# EAGLE design 4ch (EAGLE 5.11)

## Sheet 1 of 4
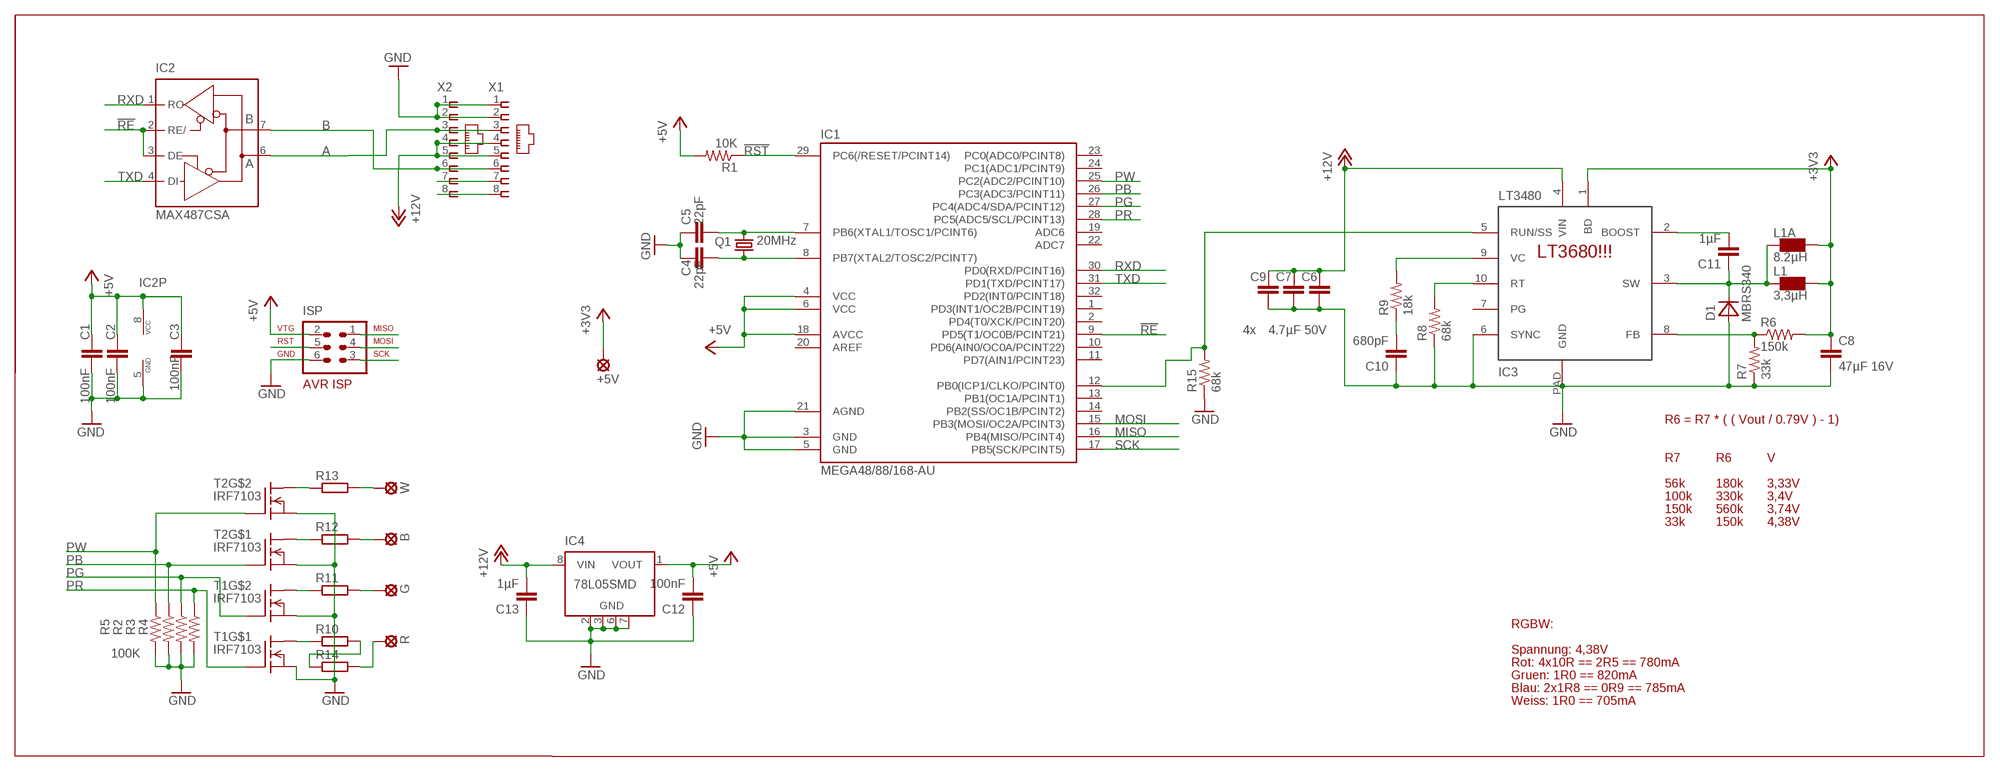
[diagram p0: schematic, sheet 1]

### Parts
+5V  SE14  [SE14]
B  SE14  [SE14]
C1  100nF  CAP0402-CAP  [0402-CAP]
C2  100nF  CAP0402-CAP  [0402-CAP]
C3  100nF  CAP0402-CAP  [0402-CAP]
C4  22pF  CAP0402-CAP  [0402-CAP]
C5  22pF  CAP0402-CAP  [0402-CAP]
C6  4.7µF 50V  CAP1210  [1210]
C7  4.7µF 50V  CAP1210  [1210]
C8  47µF 16V  CAP1210  [1210]
C9  4.7µF 50V  CAP1210  [1210]
C10  680pF  CAP0805  [0805]
C11  1µF  CAP0805  [0805]
C12  100nF  CAP0402-CAP  [0402-CAP]
C13  1µF  CAP0805  [0805]
D1  MBRS340  [DO214AB]
G  SE14  [SE14]
IC1  MEGA48/88/168-AU  [TQFP32-08]
IC2  MAX487CSA  MAX481CSA  [SO08]
IC3  LT3972  LT3480  [MSOP10-PAD]
IC4  78L05SMD  [SO08]
ISP  AVR-ISP-6  [AVR-ISP-6]
L1  3,3µH  TDK_RLF7030  [RLF7030]
L1A  8.2µH  IHLP-2525CZ  [IHLP-2525CZ]
Q1  20MHz  X22-OSCILLATOR  [X22]
R  SE14  [SE14]
R1  10K  RESISTOR0402-RES  [0402-RES]
R2  100K  RESISTOR0402-RES  [0402-RES]
R3  100K  RESISTOR0402-RES  [0402-RES]
R4  100K  RESISTOR0402-RES  [0402-RES]
R5  100K  RESISTOR0402-RES  [0402-RES]
R6  150k  RESISTOR0805-RES  [0805]
R7  33k  RESISTOR0805-RES  [0805]
R8  68k  RESISTOR0805-RES  [0805]
R9  18k  RESISTOR0805-RES  [0805]
R10  R-EU_MELF0207R  [MINI_MELF-0207R]
R11  R-EU_MELF0207R  [MINI_MELF-0207R]
R12  R-EU_MELF0207R  [MINI_MELF-0207R]
R13  R-EU_MELF0207R  [MINI_MELF-0207R]
R14  R-EU_MELF0207R  [MINI_MELF-0207R]
R15  68k  RESISTOR0402-RES  [0402-RES]
T1  IRF7103  [SO-8]
T2  IRF7103  [SO-8]
W  SE14  [SE14]
X1  RJ45-8L-B  [RJ45-NO-SHIELD]
X2  RJ45-8L-B  [RJ45-NO-SHIELD]

### Nets
!RE: IC1.9(PD5(T1/OC0B/PCINT21)) IC2.2(RE/) IC2.3(DE)
!RST: IC1.29(PC6(/RESET/PCINT14)) ISP.5 R1.1
+3V3: +5V.MP C8.1 IC3.1(BD) L1.P$1 L1A.P$1 R6.2
+5V: C1.1 C2.1 C3.1 C12.2 IC1.4(VCC) IC1.6(VCC) IC1.18(AVCC) IC2.8(VCC) IC4.1(VOUT) ISP.2 R1.2
+12V: C6.1 C7.1 C9.1 C13.2 IC3.4(VIN) IC4.8(VIN) X1.4 X1.5 X2.4 X2.5
A: IC2.6(A) X1.3 X2.3
B: IC2.7(B) X1.6 X2.6
GND: C1.2 C2.2 C3.2 C4.1 C5.1 C6.2 C7.2 C8.2 C9.2 C10.1 C12.1 C13.1 D1.A IC1.3(GND) IC1.5(GND) IC1.21(AGND) IC2.5(GND) IC3.6(SYNC) IC3.PAD(GND) IC4.2(GND) IC4.3(GND) IC4.6(GND) IC4.7(GND) ISP.6 R2.2 R3.2 R4.2 R5.2 R7.1 R8.1 R15.1 T1.1(S) T1.3(S) T2.1(S) T2.3(S) X1.1 X1.2 X2.1 X2.2
MISO: IC1.16(PB4(MISO/PCINT4)) ISP.1
MOSI: IC1.15(PB3(MOSI/OC2A/PCINT3)) ISP.4
N$1: R10.1 T1.8(D1)
N$2: R13.2 W.MP
N$3: R13.1 T2.5(D1)
N$4: R11.1 T1.5(D1)
N$5: R12.1 T2.8(D1)
N$6: IC3.10(RT) R8.2
N$8: G.MP R11.2
N$9: B.MP R12.2
N$10: C10.2 R9.1
N$11: R10.2 R14.1
N$12: IC1.12(PB0(ICP1/CLKO/PCINT0)) IC3.5(RUN/SS) R15.2
N$13: R14.2 R.MP
N$14: IC3.9(VC) R9.2
N$15: C11.1 D1.K(C) IC3.3(SW) L1.P$2 L1A.P$2
N$16: IC3.8(FB) R6.1 R7.2
N$17: C11.2 IC3.2(BOOST)
N$18: X1.7 X2.7
N$19: X1.8 X2.8
PB: IC1.26(PC3(ADC3/PCINT11)) R2.1 T2.2(G)
PG: IC1.27(PC4(ADC4/SDA/PCINT12)) R3.1 T1.4(G)
PR: IC1.28(PC5(ADC5/SCL/PCINT13)) R4.1 T1.2(G)
PW: IC1.25(PC2(ADC2/PCINT10)) R5.1 T2.4(G)
RXD: IC1.30(PD0(RXD/PCINT16)) IC2.1(RO)
SCK: IC1.17(PB5(SCK/PCINT5)) ISP.3
TXD: IC1.31(PD1(TXD/PCINT17)) IC2.4(DI)
XTAL1: C5.2 IC1.7(PB6(XTAL1/TOSC1/PCINT6)) Q1.3
XTAL2: C4.2 IC1.8(PB7(XTAL2/TOSC2/PCINT7)) Q1.1
Unconnected: IC1.1(PD3(INT1/OC2B/PCINT19)) IC1.2(PD4(T0/XCK/PCINT20)) IC1.10(PD6(AIN0/OC0A/PCINT22)) IC1.11(PD7(AIN1/PCINT23)) IC1.13(PB1(OC1A/PCINT1)) IC1.14(PB2(SS/OC1B/PCINT2)) IC1.19(ADC6) IC1.20(AREF) IC1.22(ADC7) IC1.23(PC0(ADC0/PCINT8)) IC1.24(PC1(ADC1/PCINT9)) IC1.32(PD2(INT0/PCINT18)) IC3.7(PG) IC4.4(NC) IC4.5(NC) T1.6(D) T1.7(D) T2.6(D) T2.7(D)

### Notes on the sheet
- LT3680!!!
- 4x
- R6 = R7 * ( ( Vout / 0.79V ) - 1)
- R7 | R6 | V
- 56k | 180k | 3,33V
- 100k | 330k | 3,4V
- 150k | 560k | 3,74V
- 33k | 150k | 4,38V
- RGBW:
- Spannung: 4,38V
- Rot: 4x10R == 2R5 == 780mA
- Gruen: 1R0 == 820mA
- Blau: 2x1R8 == 0R9 == 785mA
- Weiss: 1R0 == 705mA

## Sheet 2 of 4
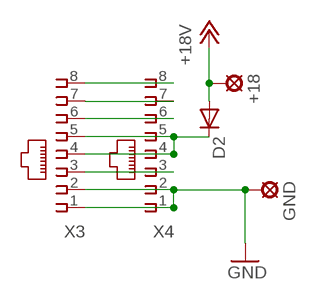
[diagram p1: schematic, sheet 2]

### Parts
+18  SE14  [SE14]
D2  DIODE-TO220V  [TO220ACS]
GND  SE14  [SE14]
X3  RJ45-8L-B  [RJ45-NO-SHIELD]
X4  RJ45-8L-B  [RJ45-NO-SHIELD]

### Nets
+18V: +18.MP D2.A
+18V_PI: D2.C X3.4 X3.5 X4.4 X4.5
A_PI: X3.3 X4.3
B_PI: X3.6 X4.6
GND_PI: GND.MP X3.1 X3.2 X4.1 X4.2 ; supply symbol labelled GND
N$20: X3.7 X4.7
N$21: X3.8 X4.8

## Sheet 3 of 4
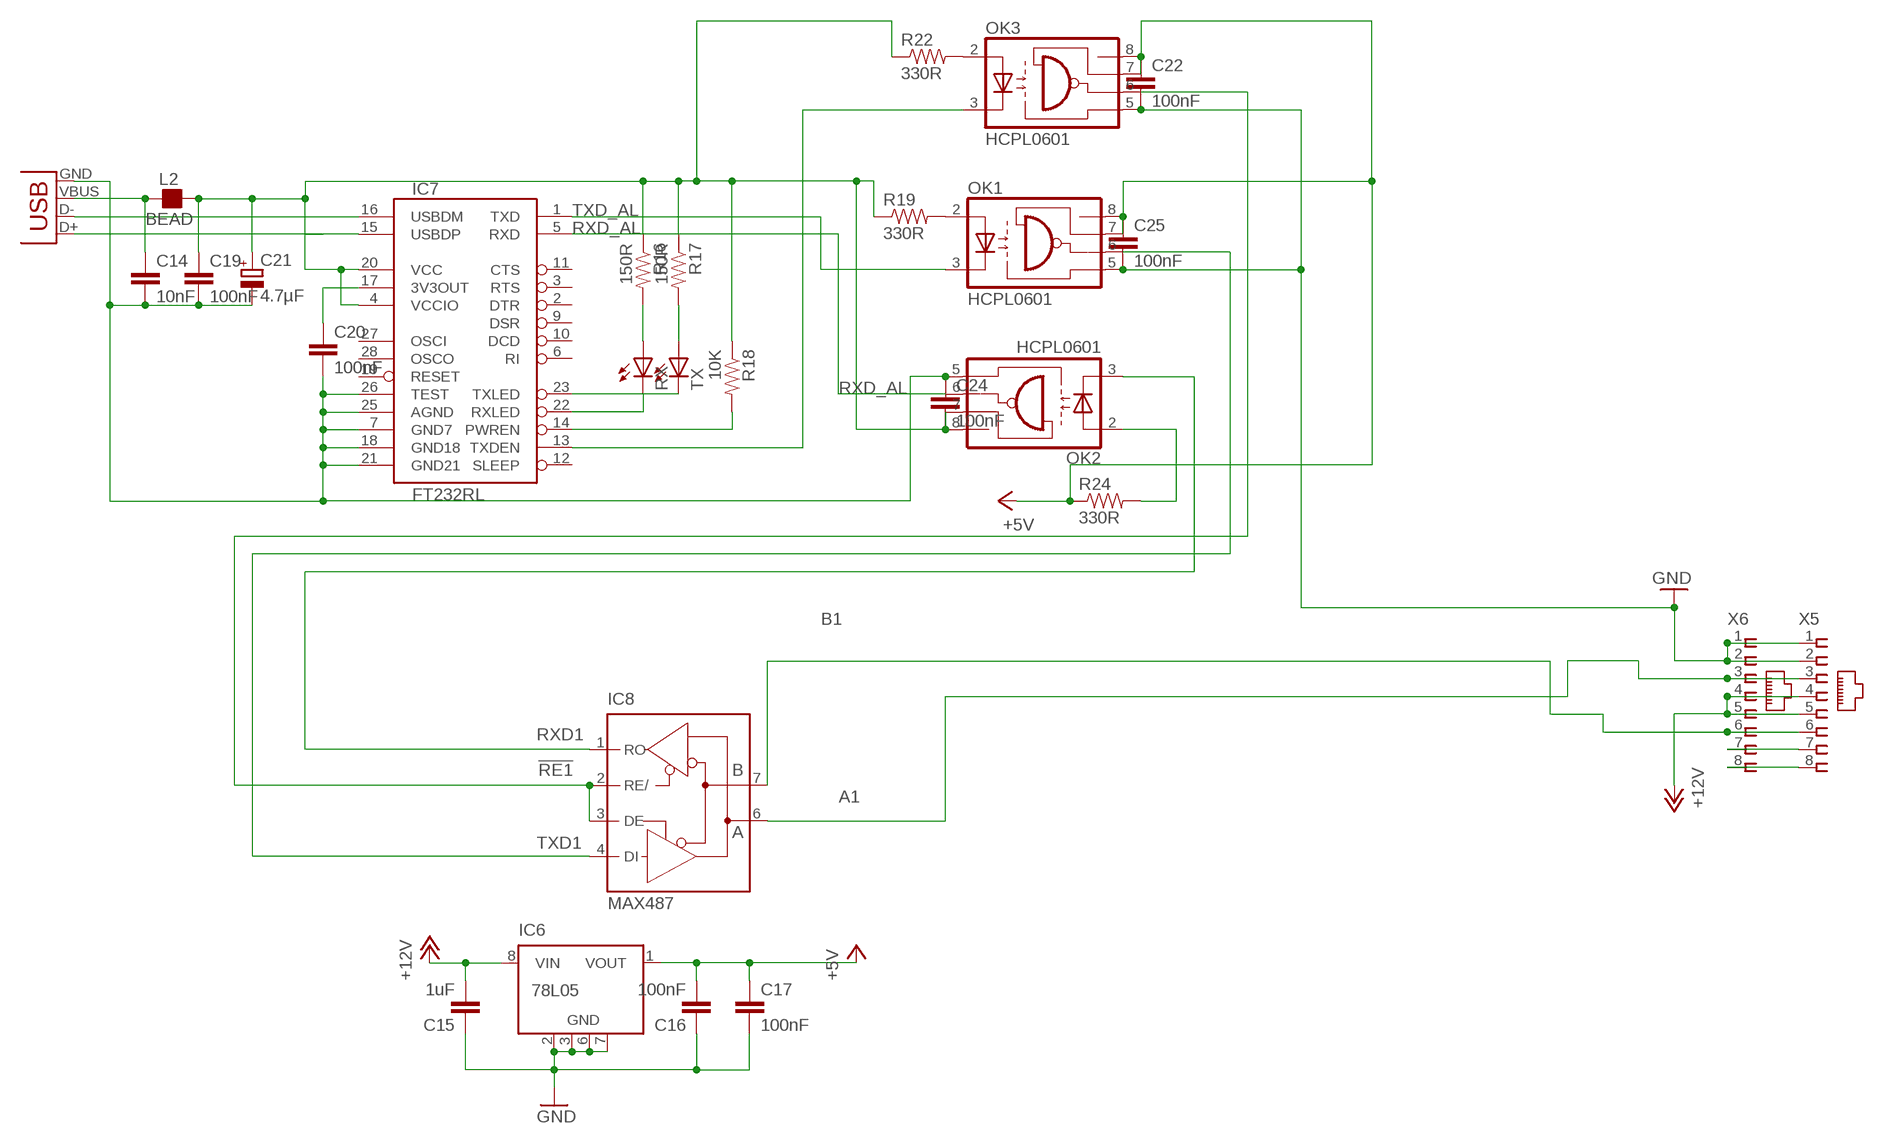
[diagram p2: schematic, sheet 3]

### Parts
C14  10nF  CAP0805  [0805]
C15  1uF  CAP0805  [0805]
C16  100nF  CAP0805  [0805]
C17  100nF  CAP0805  [0805]
C19  100nF  CAP0805  [0805]
C20  100nF  CAP0805  [0805]
C21  4.7µF  CPOL-EUSMCC  [SMC_C]
C22  100nF  CAP0805  [0805]
C24  100nF  CAP0805  [0805]
C25  100nF  CAP0805  [0805]
IC6  78L05  78L05SMD  [SO08]
IC7  FT232RL  FT232RLSSOP  [SSOP28DB]
IC8  MAX487  MAX481CSA  [SO08]
L2  BEAD  FB_0805  [L0805]
OK1  HCPL0601  [SOIC08]
OK2  HCPL0601  [SOIC08]
OK3  HCPL0601  [SOIC08]
R16  150R  RESISTOR0805-RES  [0805]
R17  150R  RESISTOR0805-RES  [0805]
R18  10K  RESISTOR0805-RES  [0805]
R19  330R  RESISTOR0805-RES  [0805]
R22  330R  RESISTOR0805-RES  [0805]
R24  330R  RESISTOR0805-RES  [0805]
RX  LEDCHIP-LED0805  [CHIP-LED0805]
TX  LEDCHIP-LED0805  [CHIP-LED0805]
X5  RJ45-8L-B  [RJ45-NO-SHIELD]
X6  RJ45-8L-B  [RJ45-NO-SHIELD]
X7  USB-SMD-NS  [USB-MINIB-NOSTOP]

### Nets
!RE1: IC8.2(RE/) IC8.3(DE) OK3.6(VO)
+5V1: C16.2 C17.1 C22.1 C25.1 IC6.1(VOUT) OK1.7(VE) OK1.8(VCC) OK3.7(VE) OK3.8(VCC) R24.1 ; supply symbol labelled +5V
+24V: C15.2 IC6.8(VIN) X5.4 X5.5 X6.4 X6.5 ; supply symbol labelled +12V
+USB_SIEVED: C19.1 C21.+ C24.2 IC7.4(VCCIO) IC7.20(VCC) L2.2 OK2.7(VE) OK2.8(VCC) R16.1 R17.1 R18.1 R19.1 R22.1
A1: IC8.6(A) X5.3 X6.3
B1: IC8.7(B) X5.6 X6.6
GND_AL: C15.1 C16.1 C17.2 C22.2 C25.2 IC6.2(GND) IC6.3(GND) IC6.6(GND) IC6.7(GND) OK1.5(GND) OK3.5(GND) X5.1 X5.2 X6.1 X6.2 ; supply symbol labelled GND
GND_USB: C14.2 C19.2 C20.2 C21.- C24.1 IC7.7(GND7) IC7.18(GND18) IC7.21(GND21) IC7.25(AGND) IC7.26(TEST) OK2.5(GND) X7.GND
N$7: IC7.16(USBDM) X7.D-
N$22: X5.8 X6.8
N$23: X5.7 X6.7
N$24: IC7.15(USBDP) X7.D+
N$25: R16.2 RX.A
N$26: R17.2 TX.A
N$27: IC7.22(RXLED) RX.C
N$28: IC7.23(TXLED) TX.C
N$29: C20.1 IC7.17(3V3OUT)
N$30: C14.1 L2.1 X7.VBUS
N$31: IC7.14(PWREN) R18.2
N$32: OK1.2(A) R19.2
N$35: IC7.13(TXDEN) OK3.3(C)
N$37: OK2.2(A) R24.2
N$44: OK3.2(A) R22.2
RXD1: IC8.1(RO) OK2.3(C)
RXD_AL: IC7.5(RXD) OK2.6(VO)
TXD1: IC8.4(DI) OK1.6(VO)
TXD_AL: IC7.1(TXD) OK1.3(C)
Unconnected: IC6.4(NC) IC6.5(NC) IC7.2(DTR) IC7.3(RTS) IC7.6(RI) IC7.9(DSR) IC7.10(DCD) IC7.11(CTS) IC7.12(SLEEP) IC7.19(RESET) IC7.27(OSCI) IC7.28(OSCO)

## Sheet 4 of 4
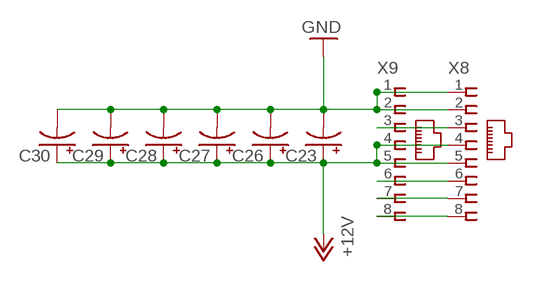
[diagram p3: schematic, sheet 4]

### Parts
C23  CAP_POLH13  [PANASONIC_H13]
C26  CAP_POLH13  [PANASONIC_H13]
C27  CAP_POLH13  [PANASONIC_H13]
C28  CAP_POLH13  [PANASONIC_H13]
C29  CAP_POLH13  [PANASONIC_H13]
C30  CAP_POLH13  [PANASONIC_H13]
X8  RJ45-8L-B  [RJ45-NO-SHIELD]
X9  RJ45-8L-B  [RJ45-NO-SHIELD]

### Nets
+24V_SB: C23.+ C26.+ C27.+ C28.+ C29.+ C30.+ X8.4 X8.5 X9.4 X9.5 ; supply symbol labelled +12V
A1_1: X8.3 X9.3
B1_1: X8.6 X9.6
GND_SB: C23.- C26.- C27.- C28.- C29.- C30.- X8.1 X8.2 X9.1 X9.2 ; supply symbol labelled GND
N$33: X8.8 X9.8
N$34: X8.7 X9.7

## Power pins joined to a net without a drawn wire
+5V1: IC8.8(VCC)
GND_AL: IC8.5(GND)

## Library data of the parts
+5V +18 B G GND R W = solpad:SE14: SOLDER PAD E1553, drill 1,4mm, distributor Buerklin, 07F820
C1-C17 C19 C20 C22 C24 C25 = SparkFun:CAP: Capacitor Standard 0603 ceramic capacitor, and 0.1" leaded capacitor.
C21 = resistor:CPOL-EU: POLARIZED CAPACITOR, European symbol
C23 C26-C30 = SparkFun:CAP_POL: Capacitor Polarized These are standard SMD and PTH capacitors. Normally 10uF, 47uF, and 100uF in electrolytic and tantalum varieties. Always verify the external diameter of the through hole cap, it varies with capacity, voltage, and manufacturer. The EIA devices should be standard.
D1 = seb:MBRS340
D2 = diode:DIODE-: DIODE
IC1 = avr-7:MEGA48/88/168
IC2 IC8 = maxim:MAX481CSA: RS485 TRANSEIVER; MF: MAXIM; MPN: MAX481CSA; OC_FARNELL: unknown; OC_NEWARK: 90C3817
IC3 = seb:LT3480
IC4 IC6 = linear:78L*SMD: Positive VOLTAGE REGULATOR
IC7 = SparkFun:FT232RL: USB UART FT232RL 4th Generation USB UART (USB <-> Serial) Controller. Spark Fun Electronics SKU : COM-00650
ISP = atmel:AVR-ISP-6: AVR ISP-6 Serial Programming Header
L1 = seb:TDK_RLF7030
L1A = seb:IHLP-2525CZ
L2 = rc-master-smd:FB_: FERRITE BEAD
OK1-OK3 = optocoupler:HCPL0601: HEWLETT PACKARD OPTO COUPLER; MF: AGILENT TECHNOLOGIES; MPN: HCPL-0601-000E; OC_FARNELL: 9995102; OC_NEWARK: 88H7776
Q1 = seb:X22-OSCILLATOR
R1-R9 R15-R19 R22 R24 = SparkFun:RESISTOR: Resistor Basic schematic elements and footprints for 0603, 1206, and PTH resistors.
R10-R14 = rcl:R-EU_: RESISTOR, European symbol
RX TX = led:LED: LED OSRAM: - CHIPLED LG R971, LG N971, LY N971, LG Q971, LY Q971, LO R971, LY R971 LH N974, LH R974 LS Q976, LO Q976, LY Q976 LO Q996 - Hyper CHIPLED LW Q18S LB Q993, LB Q99A, LB R99A - SideLED LS A670, LO A670, LY A670, LG A670, LP A670 LB A673, LV A673, LT A673, LW A673 LH A674 LY A675 LS A676, LA A676, LO A676, LY A676, LW A676 LS A679, LY A679, LG A679 - Hyper Micro SIDELED® LS Y876, LA Y876, LO Y876, LY Y876 LT Y87S - SmartLED LW L88C, LW L88S LB L89C, LB L89S, LG L890 LS L89K, LO L89K, LY L89K LS L896, LA L896, LO L896, LY L896 - TOPLED LS T670, LO T670, LY T670, LG T670, LP T670 LSG T670, LSP T670, LSY T670, LOP T670, LYG T670 LG T671, LOG T671, LSG T671 LB T673, LV T673, LT T673, LW T673 LH T674 LS T676, LA T676, LO T676, LY T676, LB T676, LH T676, LSB T676, LW T676 LB T67C, LV T67C, LT T67C, LS T67K, LO T67K, LY T67K, LW E67C LS E67B, LA E67B, LO E67B, LY E67B, LB E67C, LV E67C, LT E67C LW T67C LS T679, LY T679, LG T679 LS T770, LO T770, LY T770, LG T770, LP T770 LB T773, LV T773, LT T773, LW T773 LH T774 LS E675, LA E675, LY E675, LS T675 LS T776, LA T776, LO T776, LY T776, LB T776 LHGB T686 LT T68C, LB T68C - Hyper Mini TOPLED® LB M676 - Mini TOPLED Santana® LG M470 LS M47K, LO M47K, LY M47K Source: http://www.osram.convergy.de LUXEON: - LUMILED® LXK2-PW12-R00, LXK2-PW12-S00, LXK2-PW14-U00, LXK2-PW14-V00 LXK2-PM12-R00, LXK2-PM12-S00, LXK2-PM14-U00 LXK2-PE12-Q00, LXK2-PE12-R00, LXK2-PE12-S00, LXK2-PE14-T00, LXK2-PE14-U00 LXK2-PB12-K00, LXK2-PB12-L00, LXK2-PB12-M00, LXK2-PB14-N00, LXK2-PB14-P00, LXK2-PB14-Q00 LXK2-PR12-L00, LXK2-PR12-M00, LXK2-PR14-Q00, LXK2-PR14-R00 LXK2-PD12-Q00, LXK2-PD12-R00, LXK2-PD12-S00 LXK2-PH12-R00, LXK2-PH12-S00 LXK2-PL12-P00, LXK2-PL12-Q00, LXK2-PL12-R00 Source: www.luxeon.com KINGBRIGHT: KA-3528ASYC Source: www.kingbright.com
T1 T2 = transistor-fet+irf7201:IRF7103
X1-X6 X8 X9 = con-tycoelectronics:RJ45: CORCOM Modular RJ Jacks No Shield Source: www.tycoelectronics.com .. ENG_DS_1654001_1099_RJ_L_0507.pdf; MF: TYCO ELECTRONICS; MPN: RJ45-8L-B; OC_FARNELL: 1279843; OC_NEWARK: 52K4445
X7 = SparkFun:USB: USB Connectors USB-B-PTH is fully proven SKU : PRT-00139 USB-miniB is fully proven SKU : PRT-00587 USB-A-PCB is untested. USB-A-H is throughly reviewed, but untested. Spark Fun Electronics SKU : PRT-00437 USB-B-SMT is throughly reviewed, but untested. Needs silkscreen touching up. USB-A-S has not been used/tested USB-MB-H has not been used/tested

## Board
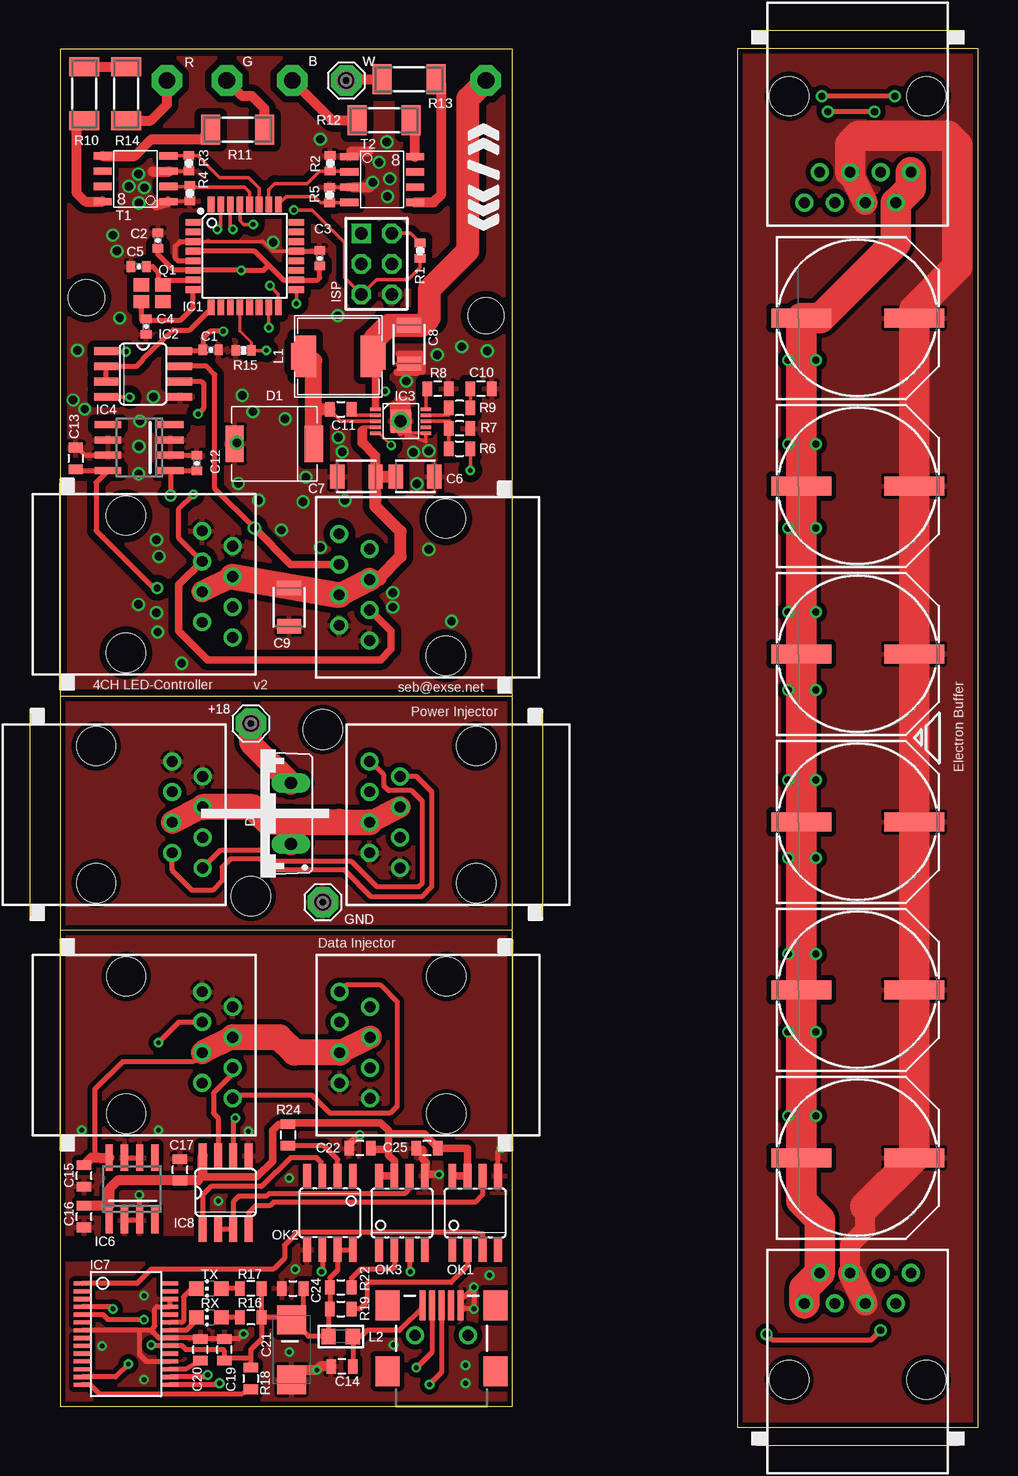
[diagram p4: board, top side]
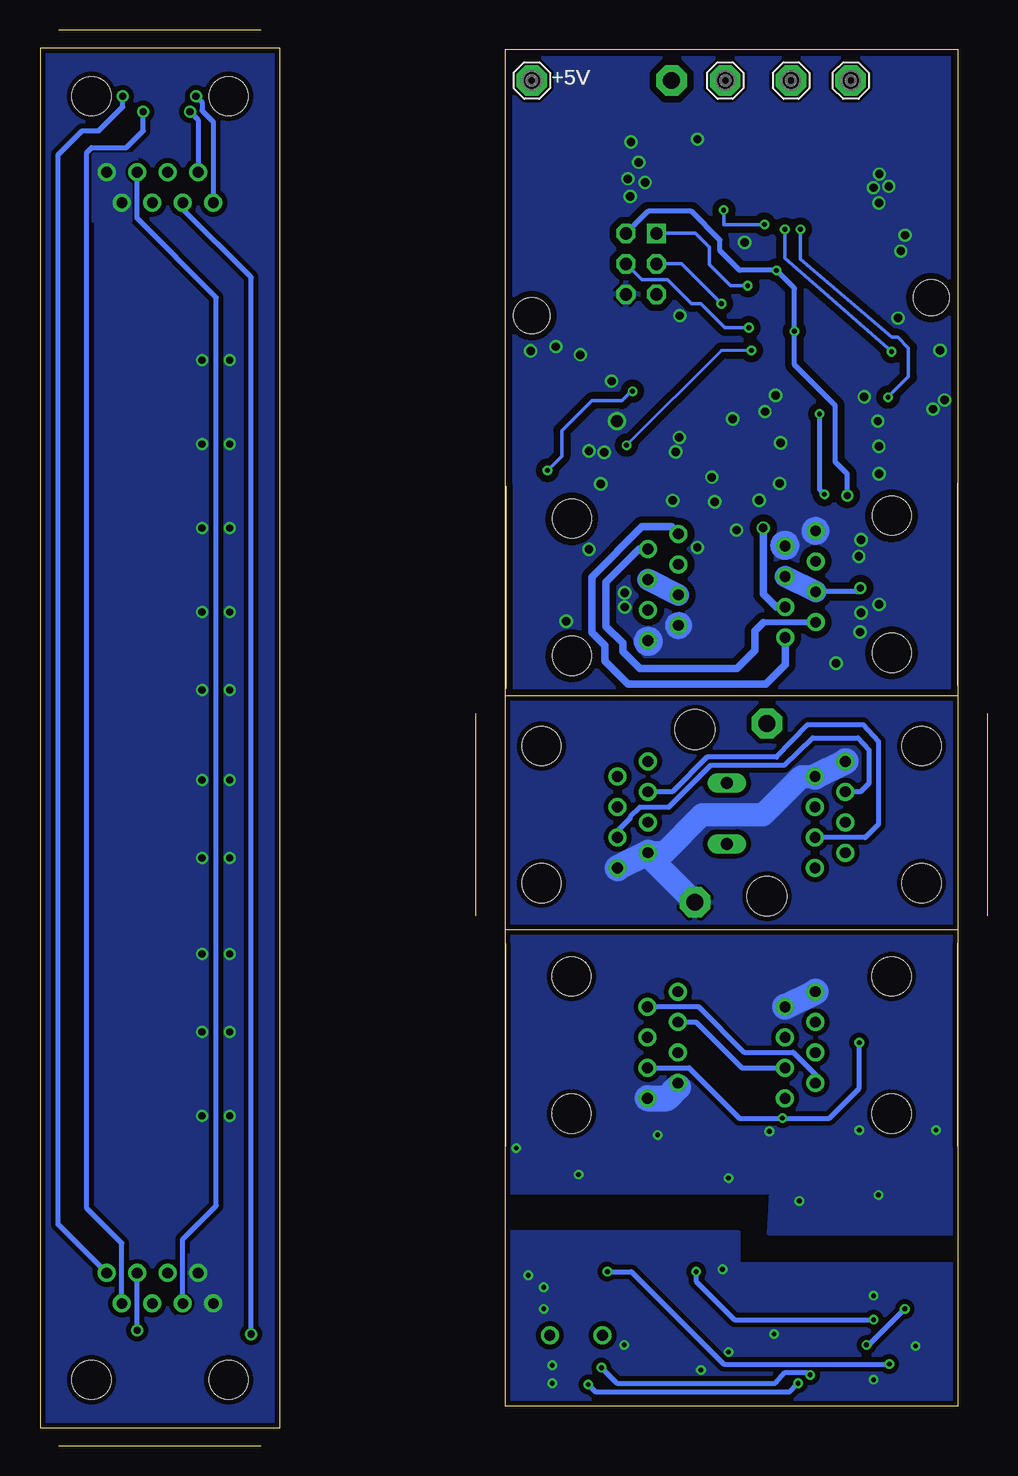
[diagram p5: board, bottom side, seen from below]

Size 79.01 x 118.02 mm. Coordinates in mm from the lower left corner, seen from the top.
Outline: 2.51,62.51 40.21,62.51
Outline: 40.21,62.51 40.21,116.41 2.51,116.41 2.51,62.51
Outline: 2.51,62.51 2.51,43.01
Outline: 2.51,43.01 40.21,43.01
Outline: 40.21,43.01 40.21,62.51
Outline: 2.51,43.01 2.51,3.31 40.21,3.31 40.21,43.01
Outline: 59.01,116.51 79.01,116.51 79.01,1.51 59.01,1.51 59.01,116.51
Copper layers (1*16): Top 0.035mm / dielectric 1.5mm / Bottom 0.035mm
Design rules "default *": minimum track width 0.2mm, minimum drill 0.4mm, track to track 0.2mm, track to pad 0.2mm, pad to pad 0.2mm, via to via 0.2mm, smd to smd 0mil, copper to edge 0.4mm, drill to drill 8mil, minimum pad ring 0.3mm, minimum via ring 8mil, stop-mask expansion 4mil, vias tented up to drill 40mil, thermal gap 10mil
Holes 3.3 mm at 18.41,45.81 24.41,59.71
Holes 3 mm at 38.01,94.21 4.71,95.71

### Footprints (pad centres in the part's own frame; a part is rotated, then mirrored left to right if it is on the bottom)
SE14 = drill 1.397 pad 2.54 octagon: MP 0,0
0402-CAP = smd 0.7 x 0.9: 1 -0.65,0; 2 0.65,0
1210 = smd 1.2 x 2: 1 -1.6,0; 2 1.6,0
0805 = smd 0.8 x 1.2: 1 -0.9,0; 2 0.9,0
SMC_C = smd 2.4 x 2.4: + -2.5,0; - 2.5,0
PANASONIC_H13 = smd 5 x 1.6: + 4.7,0; - -4.7,0
DO214AB = smd 1.52 x 3.07: A 3.305,0; K -3.305,0
TO220ACS = drill 1.016 long: A 2.54,-2.54; C -2.54,-2.54
TQFP32-08 = smd 1.27 x 0.559: 1 -4.293,2.8; 2 -4.293,2; 3 -4.293,1.2; 4 -4.293,0.4; 5 -4.293,-0.4; 6 -4.293,-1.2; 7 -4.293,-2; 8 -4.293,-2.8; 17 4.293,-2.8; 18 4.293,-2; 19 4.293,-1.2; 20 4.293,-0.4; 21 4.293,0.4; 22 4.293,1.2; 23 4.293,2; 24 4.293,2.8 | smd 0.559 x 1.27: 9 -2.8,-4.293; 10 -2,-4.293; 11 -1.2,-4.293; 12 -0.4,-4.293; 13 0.4,-4.293; 14 1.2,-4.293; 15 2,-4.293; 16 2.8,-4.293; 25 2.8,4.293; 26 2,4.293; 27 1.2,4.293; 28 0.4,4.293; 29 -0.4,4.293; 30 -1.2,4.293; 31 -2,4.293; 32 -2.8,4.293
SO08 = smd 0.66 x 2.032: 1 -1.905,-3.073; 2 -0.635,-3.073; 3 0.635,-3.073; 4 1.905,-3.073; 5 1.905,3.073; 6 0.635,3.073; 7 -0.635,3.073; 8 -1.905,3.073
MSOP10-PAD = smd 0.305 x 0.889: 1 -1,-2.095; 2 -0.5,-2.095; 3 0,-2.095; 4 0.5,-2.095; 5 1,-2.095; 6 1,2.095; 7 0.5,2.095; 8 0,2.095; 9 -0.5,2.095; 10 -1,2.095 | smd 1.88 x 1.68: PAD 0,0
SO08' = smd 0.6 x 2.2: 1 -1.905,-2.6; 2 -0.635,-2.6; 3 0.635,-2.6; 4 1.905,-2.6; 5 1.905,2.6; 6 0.635,2.6; 7 -0.635,2.6; 8 -1.905,2.6
SSOP28DB = smd 0.348 x 1.397: 1 -4.225,-3.656; 2 -3.575,-3.656; 3 -2.925,-3.656; 4 -2.275,-3.656; 5 -1.625,-3.656; 6 -0.975,-3.656; 7 -0.325,-3.656; 8 0.325,-3.656; 9 0.975,-3.656; 10 1.625,-3.656; 11 2.275,-3.656; 12 2.925,-3.656; 13 3.575,-3.656; 14 4.225,-3.656; 15 4.225,3.656; 16 3.575,3.656; 17 2.925,3.656; 18 2.275,3.656; 19 1.625,3.656; 20 0.975,3.656; 21 0.325,3.656; 22 -0.325,3.656; 23 -0.975,3.656; 24 -1.625,3.656; 25 -2.275,3.656; 26 -2.925,3.656; 27 -3.575,3.656; 28 -4.225,3.656
AVR-ISP-6 = drill 1.016 square: 1 -2.54,-1.27 | drill 1.016 octagon: 2 -2.54,1.27; 3 0,-1.27; 4 0,1.27; 5 2.54,-1.27; 6 2.54,1.27
RLF7030 = smd 2 x 2.2: P$1 -2.95,0; P$2 2.95,0
IHLP-2525CZ = smd 1.83 x 3.43: P$1 -2.77,0; P$2 2.77,0
L0805 = smd 1.2 x 1.3: 1 -1.016,0; 2 1.016,0
SOIC08 = smd 0.66 x 2.032: 1 -1.905,-3.073; 2 -0.635,-3.073; 3 0.635,-3.073; 4 1.905,-3.073; 5 1.905,3.073; 6 0.635,3.073; 7 -0.635,3.073; 8 -1.905,3.073
X22 = smd 1.3 x 1.1: 1 0.9,0.7; 2 -0.9,0.7; 3 -0.9,-0.7; 4 0.9,-0.7
0402-RES = smd 0.7 x 0.9: 1 -0.65,0; 2 0.65,0
MINI_MELF-0207R = smd 1.6 x 2.5: 1 -2.25,0; 2 2.25,0
CHIP-LED0805 = smd 1.2 x 1.2: A 0,-1.05; C 0,1.05
SO-8 = smd 1.524 x 0.61: 1 -2.743,1.27; 2 -2.743,0; 3 -2.743,-1.27; 4 -2.743,-2.54; 5 2.743,-2.54; 6 2.743,-1.27; 7 2.743,0; 8 2.743,1.27
RJ45-NO-SHIELD = drill 0.9 pad 1.4 round: 1 -4.445,6.35; 2 -3.175,8.89; 3 -1.905,6.35; 4 -0.635,8.89; 5 0.635,6.35; 6 1.905,8.89; 7 3.175,6.35; 8 4.445,8.89 | hole 3.251: -5.715,0; 5.715,0
USB-MINIB-NOSTOP = smd 2.5 x 0.5: D+ 2.5,0; D- 2.5,0.8; GND 2.5,-1.6; ID 2.5,-0.8; VBUS 2.5,1.6 | smd 2.5 x 2: G1 -3,-4.5; G2 -3,4.5; G3 2.5,4.5; G4 2.5,-4.5 | drill 0.9 pad 0.8 round: H1 0,2.2 | drill 0.9 pad 0.787 round: H2 0,-2.2

### Placement (x,y rotation side)
+5V  38.01,113.81 0 bottom
+18  18.41,60.21 0 top
B  21.88,113.81 0 bottom
C1  15.08,91.36 0 top
C2  10.67,100.47 90 top
C3  24.16,99 90 top
C4  9.69,93.3 90 top
C5  9.07,98.3 0 top
C6  32.11,80.81 0 top
C7  27.21,80.81 180 top
C8  31.61,91.81 270 top
C9  21.61,69.91 270 top
C10  37.61,88.11 180 top
C11  25.91,86.41 0 top
C12  13.91,81.91 270 top
C13  3.81,82.31 270 top
C14  26.01,6.61 180 top
C15  4.51,22.51 90 top
C16  4.51,19.11 90 top
C17  12.51,23.01 90 top
C19  16.21,8.01 90 top
C20  14.21,8.01 90 top
C21  21.81,8.01 270 top
C22  27.51,24.81 180 top
C23  69.01,94.01 0 top
C24  21.91,13.11 0 top
C25  33.11,24.81 180 top
C26  69.01,80.01 0 top
C27  69.01,66.01 0 top
C28  69.01,52.01 0 top
C29  69.01,38.01 0 top
C30  69.01,24.01 0 top
D1  20.36,83.52 180 top
D2  19.21,52.71 90 top
G  16.4,113.81 0 bottom
GND  24.41,45.31 0 top
IC1  17.91,99.19 0 top
IC2  9.43,89.35 270 top
IC3  30.91,85.41 270 top
IC4  78L05SMD  [SO08']  9.11,83.21 90 top
IC6  78L05  [SO08']  8.51,21.41 0 top
IC7  8.01,9.31 270 top
IC8  16.31,21.11 0 top
ISP  28.89,98.53 270 top
L1  25.71,90.81 180 top
L1A  25.71,90.81 180 top
L2  25.91,9.11 180 top
OK1  37.11,19.41 0 top
OK2  25.01,19.41 180 top
OK3  31.01,19.41 0 top
Q1  10.18,96.07 180 top
R  11.42,113.81 0 bottom
R1  32.53,99.63 90 top
R2  25.03,106.91 90 top
R3  13.25,106.91 270 top
R4  13.33,104.41 270 top
R5  24.98,104.26 90 top
R6  35.81,83.11 0 top
R7  35.81,84.81 180 top
R8  34.01,88.11 180 top
R9  35.81,86.51 180 top
R10  4.51,112.71 90 top
R11  17.31,109.71 0 top
R12  29.51,110.51 180 top
R13  31.61,113.91 180 top
R14  8.01,112.71 270 top
R15  17.81,91.31 0 top
R16  18.41,10.71 180 top
R17  18.41,13.11 180 top
R18  18.41,5.61 270 top
R19  25.91,11.41 0 top
R22  25.91,13.21 0 top
R24  21.51,25.91 270 top
RX  14.91,10.71 90 top
T1  8.8,104.98 180 top
T2  29.36,106.19 0 top
TX  14.91,13.11 90 top
W  26.37,113.81 0 top
X1  34.67,71.57 90 top
X2  8,71.83 270 top
X3  5.51,52.61 270 top
X4  37.21,52.61 90 top
X5  8.01,33.41 270 top
X6  34.71,33.41 90 top
X7  34.31,9.21 90 top
X8  69.01,5.51 0 top
X9  69.01,112.51 180 top

### Tracks (layer width: path | path; a pad name or v marks a point on that pad's centre or on a via)
!RE
  Top 0.406: IC1.9 15.11,94.81 13.31,93.01 11.91,93.01 9.41,90.61 9.41,90.51 8.88,89.98 IC2.2 IC2.3
!RE1
  Top 0.305: OK3.6 31.65,21.45
  Top 0.406: 31.65,21.45 31.21,21.01 19.91,21.01 19.71,20.81 17.41,20.81 16.95,20.35 IC8.3 IC8.2
!RST  (via drill 0.4)
  Top 0.305: IC1.29 17.51,102.12 17.81,101.81 v18.61,101.81 | v22.01,103.01 23.51,103.01 26.21,100.31 26.21,97.4 ISP.5 27.69,95.99 28.91,97.21 31.51,97.21 32.53,98.23 R1.1
  Bottom 0.305: v18.61,101.81 22.01,101.81 v22.01,103.01
+3V3  (via drill 0.4)
  Top 0.254: L1.P$1 L1A.P$1
  Top 0.305: IC3.1 28.81,87.31 | v36.71,81.31 R6.2 | 28.81,87.91 v29.61,87.91
  Top 0.61: 28.81,86.61 28.81,87.31 28.81,87.91 28.81,90.41 L1.P$1
  Top 1.93: L1.P$1 28.66,92.16 29.91,93.41 C8.1 32.71,93.41 33.31,94.01 33.31,96.41 36.51,99.61 36.51,112.31 +5V.MP
  Bottom 0.305: v36.71,81.31 35.51,82.51 35.51,84.61 33.01,87.11 30.51,87.11 29.71,87.91 v29.61,87.91
+5V  (via drill 0.4, 0.6)
  Top 0.305: R1.2 31.74,101.07 ISP.2
  Top 0.406: C2.1 10.65,99.89 10.65,99.33 11.99,97.99 IC1.6 v17.61,97.99 19.49,97.99 19.91,98.41 | 19.91,98.41 18.74,99.59 IC1.4 | 19.91,98.41 21.14,97.19 IC1.18 23.99,97.19 24.16,97.36 C3.1 | C12.2 13.81,81.31 IC4.1 v11.71,79.21 | IC2.8 14.37,91.25 C1.1 14.43,92.33 15.01,92.91 v16.11,92.91
  Bottom 0.406: ISP.2 28.32,102.91 24.71,102.91 22.31,100.51 22.31,99.61 20.69,97.99 v17.61,97.99 16.11,96.49 v16.11,92.91 16.11,90.11 12.71,86.71 12.71,82.01 11.71,81.01 v11.71,79.21
+5V1
  Top 0.406: 29.91,26.01 29.91,26.31 | 6.61,18.41 IC6.1 6.61,20.01 | 28.51,24.71 C22.1 | 36.48,24.8 36.46,24.81 | 14.41,22.51 14.31,22.41 14.01,22.11
  Top 0.61: OK1.8 OK1.7 36.48,24.8 | OK3.8 OK3.7 30.38,23.75 29.91,24.21 29.91,24.71 | 29.91,26.31 29.21,26.91 21.71,26.91 arc90 R24.1 20.71,26.81 20.21,26.31 20.21,23.71 18.91,22.41 14.31,22.41 | 29.91,24.71 29.91,26.01 32.91,26.01 C25.1 36.46,24.81 | 29.91,24.71 28.51,24.71
  Top 0.813: 14.41,22.51 IC8.8 | 14.01,22.11 C17.1 7.31,22.11 6.61,21.41 6.61,20.01 C16.2
+12V  (via drill 0.6)
  Top 0.3: IC3.4 27.71,84.91 27.71,84.61
  Top 0.406: v10.61,71.51 10.31,71.51 5.51,76.31 5.51,80.31 IC4.8 4.12,81.31 C13.2
  Top 0.813: 27.71,84.61 27.71,83.61 28.81,82.51 C7.1
  Top 1.016: 29.01,72.21 29.11,72.31 30.91,74.11 30.91,76.21 28.81,78.31 C7.1 C6.1 | C9.1 22.89,70.94 X1.4
  Top 1.27: X1.5 29.11,72.31
  Top 1.778: X2.5 X2.4
  Top 1.93: X1.5 25.81,70.91 X1.5
  Top 2.184: X2.4 X1.4
  Bottom 0.406: v10.61,71.51 10.93,71.19 X2.5
  Bottom 1.778: X1.4 X1.5 | X2.5 X2.4
+18V
  Top 1.93: D2.A 18.41,58.59 +18.MP
+18V_PI
  Top 1.8: X4.4 X4.5
  Top 1.93: X3.4 X3.5 | D2.C 21.75,51.95 21.81,52.01
  Top 2.184: X3.4 18.58,53.25 19.81,52.01 21.81,52.01 25.79,52.01 X4.4
+24V
  Top 0.406: 14.1,32.51 X5.5 13.6,32.01 7.71,32.01 5.41,29.71 5.41,24.31 5.71,24.01 | IC6.8 6.41,23.72
  Top 0.813: IC6.8 5.71,24.01 5.11,24.01 C15.2
  Top 1.93: X5.4 X5.5 | X6.5 X6.4
  Top 2.184: X6.4 22.05,32.78 20.78,34.05 X5.4
+24V_SB
  Top 1.676: X8.4 68.38,16.78 69.65,18.05 69.65,19.95
  Top 2.05: X8.5 X8.4 | X9.5 X9.4
  Top 2.54: X9.5 68.38,108.48 69.11,109.21 76.51,109.21 77.31,108.41 77.31,98.31 73.71,94.71 C23.+ C26.+ C27.+ C28.+ C29.+ C30.+ 69.65,19.95
  pour Top (isolate 0.406): 58.81,116.71 79.31,116.71 79.31,1.21 58.81,1.21
+USB_SIEVED  (via drill 0.4)
  Top 0.406: v10.11,8.41 10.19,8.34 IC7.20 12.69,8.34 13.01,8.01 16.11,8.01 16.21,7.91 C19.1 16.41,7.31 18.41,7.31 | v6.91,11.41 6.74,11.59 IC7.4 | 18.51,6.61 R18.1 18.41,7.31 | OK2.8 OK2.7 25.65,14.65 25.01,14.01 R22.1 R19.1 24.9,11.41 L2.2 23.21,9.11 C21.+ | C24.2 22.81,11.51 C21.+ | R16.1 21.61,10.71 C21.+ | R16.1 R17.1 | 18.41,7.31 18.41,8.01 19.31,8.91 R16.1
  Bottom 0.406: v10.11,8.41 9.91,8.41 v6.91,11.41
A  (via drill 0.4)
  Top 0.406: IC2.6 14.31,88.71 14.51,88.51 14.51,86.51 v14.01,86.01 | X2.3 12.41,75.67 12.41,78.11 v13.61,79.31
  Top 0.61: X1.3 28.36,69.67 30.11,67.91 30.11,66.41 29.21,65.51 14.81,65.51 12.41,67.91 12.41,71.79 X2.3
  Bottom 0.406: v14.01,86.01 14.01,79.71 v13.61,79.31
A1  (via drill 0.4)
  Top 0.406: v17.11,27.31 16.95,27.15 IC8.6 | v10.71,33.61 12.42,35.32 X5.3
  Bottom 0.406: X6.3 24.91,31.51 20.71,27.31 v17.11,27.31 13.21,27.31 10.71,29.81 v10.71,33.61
A1_1
  Bottom 0.406: X9.3 70.92,102.32 64.31,95.71 64.31,20.01 67.11,17.22 X8.3
A_PI
  Bottom 0.406: X4.3 30.86,51.26 29.81,52.31 29.81,52.41 29.01,53.21 26.61,53.21 23.11,56.71 17.01,56.71 14.61,59.01 10.81,59.01 9.91,58.01 9.91,55.21 10.61,54.52 X3.3
B  (via drill 0.7)
  Top 0.406: IC2.7 14.74,89.98 15.41,89.31 15.41,79.81 v18.71,76.51
  Top 0.61: X1.6 21.75,73.48 v18.71,76.51
  Bottom 0.61: v18.71,76.51 18.71,71.01 17.62,69.92 X2.6
B1
  Top 0.406: X5.6 16.9,31 15.31,29.41 15.31,27.71 15.68,27.35 IC8.7
  Bottom 0.406: X5.6 20.51,31.51 24.32,35.32 X6.6
B1_1  (via drill 0.6)
  Top 0.406: v61.41,9.31 61.91,8.81 70.11,8.81 v70.92,9.62
  Bottom 0.406: v61.41,9.31 61.41,97.41 67.11,103.11 X9.6 | v70.92,9.62 X8.6
B_PI
  Bottom 0.406: X3.6 10.22,50.71 9.11,51.81 9.11,58.71 10.41,60.11 15.01,60.11 17.61,57.41 23.41,57.41 26.31,54.52 X4.6
GND  (via drill 0.7, 1)
  Top 0.254: 31.72,84.41 IC3.6 33.01,83.71
  Top 0.305: R5.2 T2.3 | T1.3 11.56,106.26 R3.2 | IC1.21 20.24,99.59 19.41,100.41 19.39,100.39 IC1.3 | T1.1 11.7,103.76 R4.2 | 30.91,84.51 33.01,83.71
  Top 0.406: IC1.5 12.34,98.79 12.06,99.06 12.06,99.95 12.5,100.39 IC1.3 | C13.1 4.65,82.58 IC4.7 | IC4.2 13.98,82.58 C12.1 | C3.2 24.1,99.59 IC1.21 | 30.31,86.71 30.51,86.71 30.91,87.11 | 32.51,91.01 32.81,90.71 32.81,89.51 32.31,89.51 C8.2
  Top 0.61: 31.31,87.21 31.51,86.01 31.51,84.21 | 30.91,84.51 IC3.PAD 30.91,87.11 30.91,87.21 | 30.31,86.71 30.31,84.71 | 32.31,89.51 30.61,89.51 | 32.51,91.01 30.81,91.01
  Top 0.813: 26.81,107.91 28.21,107.91 | 28.51,105.21 28.31,105.01 28.31,104.91 26.91,104.91 | 10.21,106.21 11.61,106.21 | 10.51,103.41 11.51,103.71
  Bottom 0.61: 13.51,76.21 arc353 13.51,76.31 14.31,76.31 X2.1 | 16.01,75.11 arc-354 16.01,75.01 | 27.41,67.11 arc-354 27.41,67.01 | X1.2 25.4,68.01 25.31,67.71 arc340 25.11,67.91
  other vias: 24.21,108.92 29.75,108.69 29.81,104.16 29.1,107 30,105.62 28.57,105.31 25.67,94.21 33.96,90.95 20.27,100.31 38.12,91.27 36.01,91.63 8.25,104.99 9.04,106.01 9.53,104.87 9.07,103.61 31.36,88.75 6.9,100.92 7.25,99.59 32.26,80.2 31.97,82.82 7.48,94.01 33.25,82.95 3.97,91.31 3.6,87.17 30.89,85.43 4.56,86.42 10.3,87.45 9.16,85.42 9.07,83.31 21.26,85.62 17.7,87.56 9.06,81.02 25.71,84.05 18.57,86.21 17.26,83.62 26.26,78.8 26.03,82.85 17.36,80.22 23,80.75 30.26,71.12 30.26,69.92 22.76,78.7 19.06,78.82 20.95,76.33 24.2,74.89 10.55,69.43 9.05,70.13 10.75,74.13 10.55,75.53 12.65,65.23 10.65,67.83 33.25,74.73 35.15,68.73
  pour Bottom (isolate 0.559, rank 2): 0.65,116.29 0.21,62.51 41.1,62.51 41.19,116.19
  pour Top (isolate 0.559, rank 2): 0.53,116.37 0.31,62.51 41.33,62.51 41.19,116.29
GND_AL  (via drill 0.4)
  Top 0.406: v9.11,20.91 9.11,18.85 IC6.3 IC6.2 | IC6.7 IC6.6 | v4.31,26.31 4.41,26.21 | 26.61,25.11 C22.2 | OK3.5 33.04,22.61 | 32.71,24.71 C25.2 | OK1.5 39.02,24.52 v39.31,24.81
  Top 0.61: v27.51,25.91 26.61,25.11 | v34.11,22.61 33.04,22.61 33.04,23.58 32.71,23.91 32.71,24.71
  Bottom 2.184: X5.2 X5.1 | X6.1 26.76,28.97 25.81,29.91
  other vias: 10.71,26.31 18.21,26.21 21.61,22.31 15.71,20.41
  pour Bottom (isolate 0.406): 41.01,42.91 1.61,42.91 1.61,17.71 18.21,17.71 18.01,21.11 41.01,21.11
  pour Top (isolate 0.406): 41.01,42.91 1.61,42.91 1.61,17.71 18.81,17.71 18.81,17.41 19.51,17.41 19.51,21.11 41.01,21.11
GND_PI
  Bottom 1.93: GND.MP 28.32,49.22 X4.2 26.99,49.44 23.81,52.61 20.01,52.61 19.61,52.61 18.71,52.61 15.54,55.79 X3.2
  Bottom 2.184: X3.2 X3.1 | X4.2 X4.1
  pour Bottom (isolate 0.406): 0.11,62.41 0.11,43.51 42.71,43.51 42.71,62.41
  pour Top (isolate 0.406): 0.11,62.41 0.11,43.51 42.71,43.51 42.71,62.41
GND_SB  (via drill 0.6)
  Top 0.406: v65.51,63.01 64.31,64.21 64.31,64.11 v63.21,63.01
  Top 1.676: X8.2 65.81,14.43
  Top 2.54: C23.- C26.- | C23.- C27.- 64.31,64.21 C28.- C29.- C30.- 64.31,20.41 65.84,18.89 X8.2 64.57,13.13 X8.1 | C23.- 65.91,94.01 72.19,100.29 X9.2 | X9.1 73.46,104.86 72.21,103.61
  other vias: 65.51,90.51 65.51,83.51 65.51,76.51 65.51,69.51 65.51,55.51 65.51,49.01 65.51,41.01 65.51,34.51 65.51,27.51 63.21,90.51 63.21,83.51 63.21,76.51 63.21,69.51 63.21,55.51 63.21,49.01 63.21,41.01 63.21,34.51 63.21,27.51
  pour Bottom (isolate 0.406): 58.81,116.71 79.31,116.71 79.31,1.21 58.81,1.21
  pour Bottom (no thermals): 62.91,15.81 67.51,15.81 67.51,9.51 62.91,9.51
  pour Bottom (no thermals): 74.81,107.61 74.81,102.21 71.01,102.21 71.01,107.61
GND_USB  (via drill 0.4)
  Top 0.406: OK2.5 22.93,16.41 | X7.GND 36.21,11.41 v37.01,11.41 v37.01,13.21 36.21,12.41 35.91,12.41 36.01,12.51 | IC7.21 11.64,9.01 10.81,9.01 | 10.09,9.64 9.11,9.64 | 9.11,9.64 IC7.7 | 10.09,9.64 10.74,8.99 IC7.21 | IC7.18 9.69,7.04 9.11,7.61 9.11,9.64 | IC7.21 14.14,8.99 C20.2 C19.2 17.41,8.91 v17.81,9.31 | IC7.26 IC7.25 10.59,11.59 10.41,11.41 10.41,9.96 10.09,9.64
  Top 0.813: C14.2 24.21,6.61 v23.91,6.31 22.61,6.31 C21.-
  other vias: 22.11,14.71 21.61,7.81 36.31,6.71 9.51,12.51 6.01,8.31 9.51,5.51 38.31,14.21 30.31,8.41 36.31,5.21
  pour Bottom (isolate 0.406): 2.11,3.31 40.71,3.31 40.71,17.81 20.81,17.81 20.81,16.81 20.81,15.11 15.81,15.11 2.11,15.11
  pour Top (isolate 0.406): 2.11,3.31 40.71,3.31 40.71,17.81 20.81,17.81 20.81,16.81 20.81,15.11 15.81,15.11 2.11,15.11
MISO  (via drill 0.4)
  Top 0.305: v20.01,96.71 20.71,96.02 IC1.16
  Bottom 0.305: v20.01,96.71 21.46,96.71 23.21,98.46 23.21,99.91 24.37,101.07 ISP.1
MOSI  (via drill 0.4)
  Top 0.305: v19.91,93.21 19.91,94.02 IC1.15
  Bottom 0.305: ISP.4 28.85,97.21 26.71,97.21 24.71,95.21 23.91,95.21 21.91,93.21 v19.91,93.21
N$1
  Top 0.813: T1.8 4.61,103.71 3.91,104.41 3.91,109.86 R10.1
N$2
  Top 0.813: R13.2 26.47,113.91 W.MP
N$3
  Top 0.813: T2.5 33.65,103.65 34.31,104.31 34.31,113.46 R13.1
N$4
  Top 0.813: T1.5 8.72,107.52 10.11,108.91 14.26,108.91 R11.1
N$5
  Top 0.813: T2.8 32.1,110.17 R12.1
N$6
  Top 0.305: IC3.10 33.01,87.51 R8.2
N$7  (via drill 0.4)
  Top 0.406: IC7.16 14.49,5.74 v14.81,5.91 | v32.21,6.51 33.51,7.81 X7.D-
  Bottom 0.406: v14.81,5.91 15.11,6.11 16.91,6.11 17.71,5.21 30.91,5.21 v32.21,6.51
N$8
  Top 0.813: R11.2 19.56,111.46 18.51,112.51 17.7,112.51 G.MP
N$9
  Top 0.813: R12.2 25.18,110.51 B.MP
N$10
  Top 0.305: R9.1 C10.2
N$11
  Top 0.813: R10.2 R14.1
N$12  (via drill 0.4)
  Top 0.254: IC3.5 29.12,84.41 v30.11,83.41 | IC1.12 17.51,92.92 18.46,91.96 R15.2
  Top 0.3: R15.2 v19.71,91.31
  Bottom 0.254: v30.11,83.41 22.21,91.31 v19.71,91.31
N$13
  Top 0.813: R14.2 10.06,110.46 11.42,111.82 R.MP
N$14
  Top 0.305: IC3.9 34.91,85.91 R9.2
N$15
  Top 0.254: L1.P$2 L1A.P$2
  Top 0.305: IC3.3 25.91,85.41 C11.1
  Top 0.61: D1.K 23.66,86.41
  Top 1.016: 23.66,86.41 C11.1
  Top 1.422: D1.K 23.66,90.43 L1.P$2
N$16
  Top 0.3: R6.1 R7.2
  Top 0.305: IC3.8 35.01,85.41 R6.1
N$17
  Top 0.305: IC3.2 26.81,85.91 C11.2
N$18
  Bottom 0.5: 14.39,68.61 18.71,68.61
  Bottom 0.61: X1.7 29.08,74.75 31.81,72.01 31.81,68.31 30.41,66.91 30.41,66.21 29.01,64.81 20.91,64.81 19.41,66.31 19.41,67.91 18.71,68.61 | X2.7 14.39,68.61
N$19
  Bottom 0.61: X1.8 26.38,76.61 28.81,76.61 33.01,72.41 33.01,67.81 31.91,66.71 31.91,65.41 30.01,63.51 18.51,63.51 16.89,65.13 X2.8
N$20
  Top 0.406: X3.7 11.86,47.96 13.51,46.31 15.21,46.31 16.01,47.11 16.01,48.21 16.71,48.91 19.21,48.91 20.11,48.01 26.21,48.01 28.41,45.81 32.71,45.81 33.51,46.61 33.51,54.51 32.24,55.79 X4.7
N$21
  Top 0.406: X4.8 28.37,57.06 29.51,55.91 29.51,55.01 29.91,54.61 31.81,54.61 32.71,53.71 32.71,46.91 32.41,46.61 28.91,46.61 26.81,48.71 20.31,48.71 19.41,49.61 15.85,49.61 X3.8
N$22
  Top 0.406: X5.8 17.15,29.21 23.51,29.21 25.01,27.71 30.01,27.71 30.61,28.31 30.61,37.01 29.21,38.41 26.38,38.41 X6.8
N$23
  Bottom 0.406: X6.7 28.34,36.61 24.11,36.61 20.31,32.81 16.21,32.81 14.36,30.96 X5.7
N$24  (via drill 0.4)
  Top 0.406: v33.31,5.11 34.31,6.11 X7.D+ | IC7.15 15.69,5.09 arc90 v15.81,5.21
  Bottom 0.406: v15.81,5.21 16.51,4.51 32.71,4.51 v33.31,5.11
N$25
  Top 0.406: R16.2 RX.A
N$26
  Top 0.406: R17.2 TX.A
N$27
  Top 0.406: IC7.22 13.04,9.64 13.86,10.46 RX.C
N$28
  Top 0.406: IC7.23 12.69,10.29 12.81,10.41 12.81,12.41 13.51,13.11 TX.C
N$29
  Top 0.406: IC7.17 12.99,6.39 C20.1
N$30
  Top 0.406: X7.VBUS 32.71,11.51 30.81,9.61 28.11,9.61 27.61,9.11 L2.1 26.93,6.61 C14.1
N$31
  Top 0.406: R18.2 17.61,4.31 5.81,4.31 5.04,5.09 IC7.14
N$32
  Top 0.406: OK1.2 36.48,14.98 35.11,13.61 28.11,13.61 28.11,12.01 27.51,11.41 R19.2
N$33  (via drill 0.6)
  Top 0.406: v72.11,112.51 v66.01,112.51
  Bottom 0.406: X8.8 77.51,18.46 77.51,107.61 75.51,109.61 74.11,109.61 72.11,111.61 v72.11,112.51 | X9.8 64.57,110.37 65.51,111.31 65.51,112.01 v66.01,112.51
N$34  (via drill 0.6)
  Top 0.406: v70.41,111.21 v66.51,111.21
  Bottom 0.406: X8.7 72.19,16.89 75.11,19.81 75.11,107.81 74.71,108.21 71.81,108.21 70.41,109.61 v70.41,111.21 | X9.7 65.84,110.54 v66.51,111.21
N$35  (via drill 0.4)
  Top 0.406: OK3.3 31.65,14.58 v31.71,14.51 | v8.21,6.81 7.14,5.74 IC7.13
  Bottom 0.406: v31.71,14.51 29.71,14.51 22.01,6.81 v8.21,6.81
N$37
  Top 0.406: OK2.2 25.65,23.88 24.51,25.01 R24.2
N$44
  Top 0.406: OK3.2 30.38,14.88 30.21,14.71 27.56,14.71 26.81,13.96 R22.2
PB
  Top 0.305: T2.2 26.54,106.26 R2.1 24.16,106.26 23.11,105.21 20.41,105.21 19.91,104.71 IC1.26
PG
  Top 0.305: IC1.27 19.11,104.82 18.21,105.71 15.81,105.71 13.96,107.56 R3.1 11.59,107.56 T1.4
PR
  Top 0.305: IC1.28 18.31,104.52 17.91,104.91 13.47,104.91 R4.1 13.25,104.98 T1.2
PW
  Top 0.305: T2.4 26.58,103.61 R5.1 24.21,103.61 23.71,104.11 21.34,104.11 IC1.25
RXD  (via drill 0.4)
  Top 0.305: IC1.30 16.71,101.62 v16.91,101.41 | v8.01,91.21 6.4,91.21 IC2.1
  Bottom 0.305: v16.91,101.41 16.91,99.01 v8.01,91.21
RXD1
  Top 0.406: OK2.3 24.28,23.65 23.91,24.01 21.71,24.01 19.31,21.61 15.11,21.61 14.41,20.91 IC8.1
RXD_AL  (via drill 0.4)
  Top 0.406: OK2.6 24.38,14.58 v24.31,14.51 | v9.51,10.51 6.51,10.51 6.09,10.94 IC7.5
  Bottom 0.406: v24.31,14.51 24.31,13.71 21.11,10.51 v9.51,10.51
SCK  (via drill 0.4)
  Top 0.305: v22.21,95.21 IC1.17
  Bottom 0.305: ISP.3 25.53,98.53 v22.21,95.21
TXD  (via drill 0.4)
  Top 0.305: IC1.31 15.91,101.71 v15.61,101.41 | v8.31,87.41 6.39,87.41 IC2.4
  Bottom 0.305: v15.61,101.41 15.61,98.91 8.01,92.41 7.51,92.41 6.61,91.51 6.61,89.11 v8.31,87.41
TXD1
  Top 0.406: OK1.6 37.75,20.95 37.11,20.31 20.31,20.31 20.01,20.01 18.81,20.01 18.22,19.42 IC8.4
TXD_AL
  Top 0.406: OK1.3 37.75,17.68 36.81,17.81 22.31,17.81 21.21,16.71 21.21,15.61 20.31,14.71 10.11,14.71 8.94,13.54 IC7.1
XTAL1
  Top 0.406: Q1.3 10.68,96.86 | Q1.3 10.67,96.79 10.67,97.77 10.23,98.3 C5.2 | Q1.3 10.68,97.19 IC1.7
XTAL2
  Top 0.406: 9.28,93.85 12.57,93.85 13.61,94.89 IC1.8 | Q1.1 9.28,93.85 | 9.28,93.85 C4.2

### Text on the board
tPlace: seb@exse.net | Electron Buffer | 4CH LED-Controller | v2 | Power Injector | Data Injector
bStop: GND
_tNames: R | G | B | W | R13 | R12 | R10 | R14 | R11 | R2 | T2 | R3 | R4 | R5 | T1 | C2 | C3 | C5 | Q1 | R1 | ISP | C4 | IC1 | C8 | IC2 | C1 | R15 | L1 | C10 | R8 | D1 | IC3 | IC4 | C11 | R9 | R7 | C13 | C12 | R6 | C7 | C6 | C9 | +18 | D2 | GND | R24 | C17 | C22 | C25 | C15 | C16 | IC8 | IC6 | OK2 | IC7 | OK3 | OK1 | TX | R17 | C24 | R22 | RX | R16 | R19 | L2 | C21 | C20 | C19 | C14 | R18
_bNames: +5V
_tValues: SE14 | RJ45-8L-B | 100K | MEGA48/88/168-AU | 3,3µH | 8.2µH | 47µF 16V | 68k | 68k | 680pF | MBRS340 | 18k | 78L05SMD | 33k | 1µF | 1µF | 100nF | LT3972 | 4.7µF 50V | 150k | 4.7µF 50V | RJ45-8L-B | 4.7µF 50V | RJ45-8L-B | SE14 | RJ45-8L-B | RJ45-8L-B | SE14 | RJ45-8L-B | RJ45-8L-B | 78L05 | MAX487 | HCPL0601 | 4.7µF | RJ45-8L-B | FT232RL | USB-SMD-NS